# Altium schematic sheet Block_Diagram.SchDoc
size A4; SheetNumber: 1; SheetTotal: 3
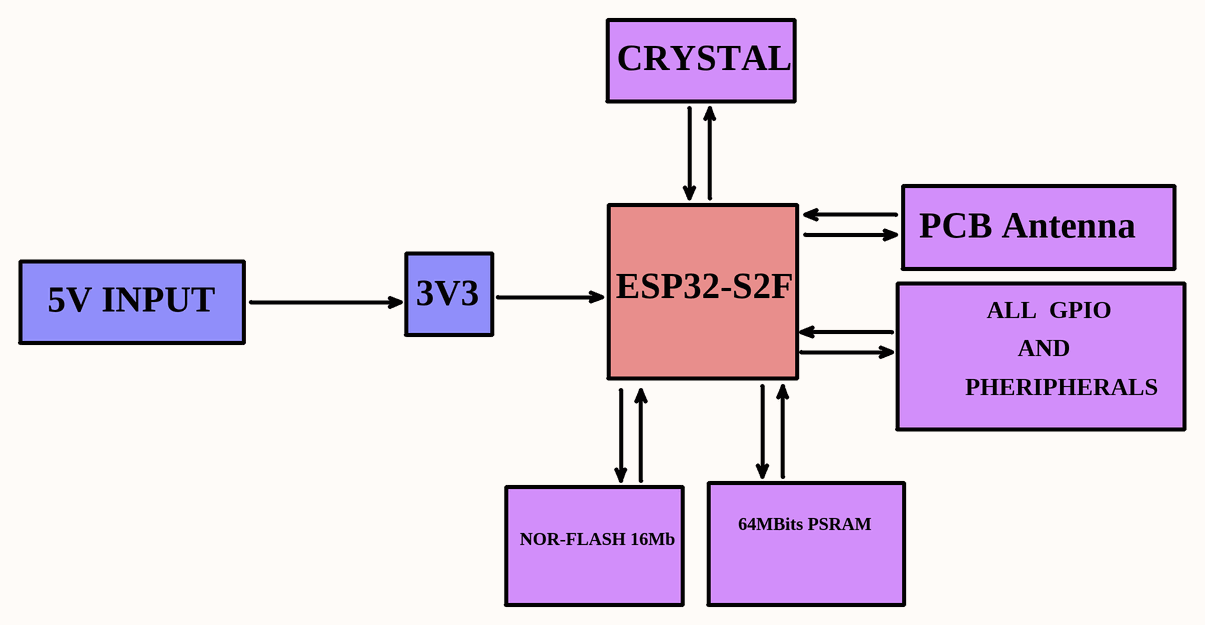
[diagram p0: Block_Diagram.SchDoc]

## Notes on the sheet
- CRYSTAL
- PCB Antenna
- 5V INPUT
- 3V3
- ESP32-S2F
- ALL  GPIO
- AND
- PHERIPHERALS
- NOR-FLASH 16Mb
- 64MBits PSRAM